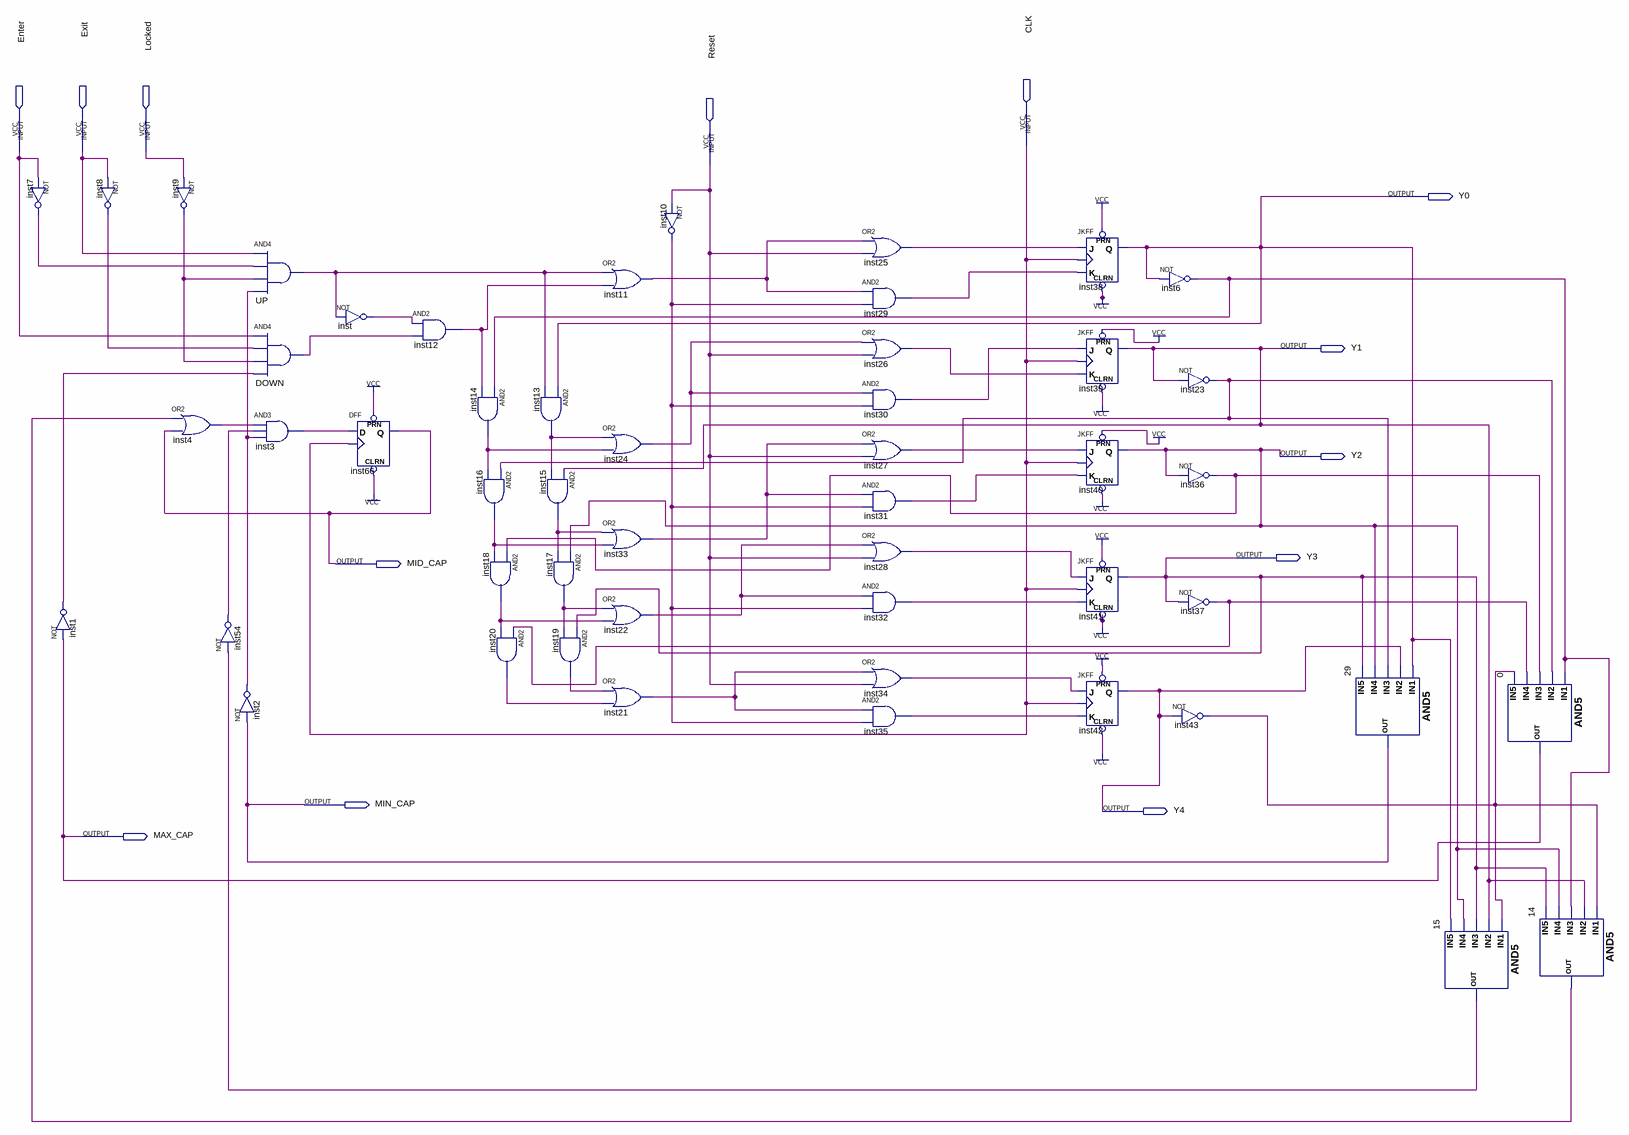
[diagram p0: schematic sheet]
// Quartus schematic Ghady.bdf as structural Verilog: 51 symbols, 13 pins
module Ghady (
  input  CLK,
  input  Enter,
  input  Exit,
  input  Locked,
  input  Reset,
  output Y0,
  output Y1,
  output Y2,
  output Y3,
  output MID_CAP,
  output MIN_CAP,
  output Y4,
  output MAX_CAP
);

  wire DOWN_out, inst1_out, inst2_out, inst3_out, inst4_out, inst6_out, inst7_out, inst8_out, inst9_out,
       inst10_out, inst11_out, inst12_out, inst13_out, inst14_out, inst15_out, inst16_out, inst17_out,
       inst18_out, inst19_out, inst20_out, inst21_out, inst22_out, inst23_out, inst24_out, inst25_out,
       inst26_out, inst27_out, inst28_out, inst29_out, inst30_out, inst31_out, inst32_out, inst33_out,
       inst34_out, inst35_out, inst36_out, inst37_out, inst43_out, inst54_out, inst_out, n14_out, n15_out,
       UP_out;

  not inst7 (inst7_out, Enter);
  not inst1 (inst1_out, MAX_CAP);
  not inst8 (inst8_out, Exit);
  not inst9 (inst9_out, Locked);
  or inst4 (inst4_out, n14_out, MID_CAP);
  and UP (UP_out, Exit, inst7_out, inst9_out, inst2_out);
  and DOWN (DOWN_out, Enter, inst8_out, inst9_out, inst1_out);
  and inst3 (inst3_out, inst4_out, inst54_out, inst2_out);
  not inst54 (inst54_out, n15_out);
  not inst2 (inst2_out, MIN_CAP);
  not inst (inst_out, UP_out);
  DFF inst66 (.CLRN(1'b1), .CLK(CLK), .D(inst3_out), .PRN(1'b1), .Q(MID_CAP));
  and inst12 (inst12_out, inst_out, DOWN_out);
  and inst14 (inst14_out, inst6_out, inst12_out);
  and inst16 (inst16_out, inst23_out, inst14_out);
  and inst18 (inst18_out, inst36_out, inst16_out);
  and inst20 (inst20_out, inst37_out, inst18_out);
  and inst13 (inst13_out, Y0, UP_out);
  and inst15 (inst15_out, Y1, inst13_out);
  and inst17 (inst17_out, Y2, inst15_out);
  and inst19 (inst19_out, Y3, inst17_out);
  or inst11 (inst11_out, UP_out, inst12_out);
  or inst24 (inst24_out, inst13_out, inst14_out);
  or inst33 (inst33_out, inst15_out, inst16_out);
  or inst22 (inst22_out, inst17_out, inst18_out);
  or inst21 (inst21_out, inst19_out, inst20_out);
  not inst10 (inst10_out, Reset);
  or inst25 (inst25_out, inst11_out, Reset);
  and inst29 (inst29_out, inst11_out, inst10_out);
  or inst26 (inst26_out, inst24_out, Reset);
  and inst30 (inst30_out, inst24_out, inst10_out);
  or inst27 (inst27_out, inst33_out, Reset);
  and inst31 (inst31_out, inst33_out, inst10_out);
  or inst28 (inst28_out, inst22_out, Reset);
  and inst32 (inst32_out, inst22_out, inst10_out);
  or inst34 (inst34_out, inst21_out, Reset);
  and inst35 (inst35_out, inst21_out, inst10_out);
  JKFF inst38 (.PRN(1'b1), .CLRN(1'b1), .K(inst29_out), .J(inst25_out), .CLK(CLK), .Q(Y0));
  JKFF inst39 (.PRN(1'b1), .CLRN(1'b1), .K(inst26_out), .J(inst30_out), .CLK(CLK), .Q(Y1));
  JKFF inst40 (.PRN(1'b1), .CLRN(1'b1), .K(inst31_out), .J(inst27_out), .CLK(CLK), .Q(Y2));
  JKFF inst41 (.PRN(1'b1), .CLRN(1'b1), .K(inst32_out), .J(inst28_out), .CLK(CLK), .Q(Y3));
  JKFF inst42 (.PRN(1'b1), .CLRN(1'b1), .K(inst35_out), .J(inst34_out), .CLK(CLK), .Q(Y4));
  not inst6 (inst6_out, Y0);
  not inst43 (inst43_out, Y4);
  not inst23 (inst23_out, Y1);
  not inst36 (inst36_out, Y2);
  not inst37 (inst37_out, Y3);
  and u_29 (MIN_CAP, Y0, Y4, inst23_out, Y2, Y3);
  and u_15 (n15_out, inst43_out, Y1, Y3, Y2, Y0);
  and u_0 (MAX_CAP, inst6_out, inst23_out, inst36_out, inst37_out, inst43_out);
  and u_14 (n14_out, inst43_out, Y1, inst6_out, Y2, Y3);
endmodule
